# Altium schematic sheet Power_Supplies.SchDoc: =DocumentName
size A4; DocumentNumber: 1; Revision: 0; SheetNumber: 3; SheetTotal: 10; Last modified by: Krzysztof Belewicz
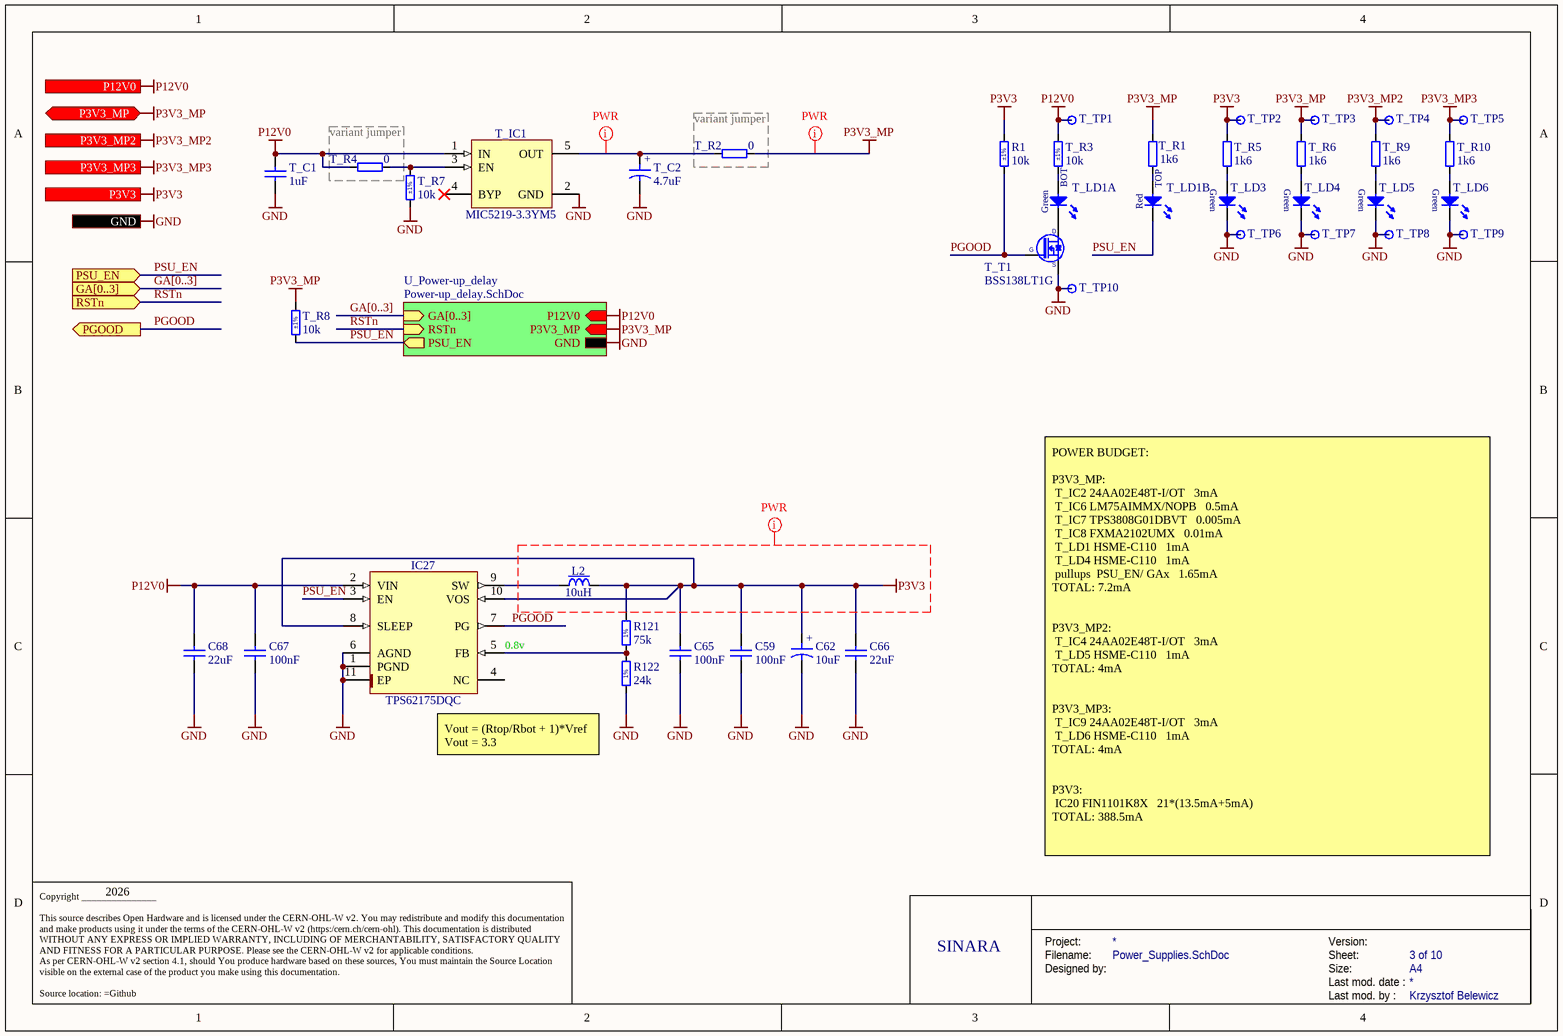
[diagram p0: Power_Supplies.SchDoc]

## Parts
C59  100nF  [CAPC1005X55N]
C62  10uF  [CAPAE430X540N]
C65  100nF  [CAPC1005X55N]
C66  22uF  [CAPC2012X135N]
C67  100nF  [CAPC1005X55N]
C68  22uF  [CAPC2012X135N]
IC27  TPS62175DQC  [SON50P200X300X80-11N-R94X250]
L2  10uH  [IND_MURATA-PS_8400]
R1  10k  Tolerance: ±1%  [RESC1005X40N]
R121  75k  [RESC1005X40N]
R122  24k  [RESC1005X40N]
T_C1  1uF  [CAPC1608X87N]
T_C2  4.7uF  [CAPMP3216X180N]
T_IC1  MIC5219-3.3YM5  [SOT95P280X145-5N]
T_LD1  Red/Green  [LED_DIALIGHT_571-0112F]  (value not drawn)  (parts A,B of 2)
T_LD3  Green  [LED_KINGBRIGHT_KPH-1608CGCK]  (value not drawn)
T_LD4  Green  [LED_KINGBRIGHT_KPH-1608CGCK]  (value not drawn)
T_LD5  Green  [LED_KINGBRIGHT_KPH-1608CGCK]  (value not drawn)
T_LD6  Green  [LED_KINGBRIGHT_KPH-1608CGCK]  (value not drawn)
T_R1  1k6  [RESC1005X40N]
T_R2  0  [RESC1005X40N]
T_R3  10k  Tolerance: ±1%  [RESC1005X40N]
T_R4  0  [RESC1005X40N]
T_R5  1k6  [RESC1005X40N]
T_R6  1k6  [RESC1005X40N]
T_R7  10k  Tolerance: ±1%  [RESC1005X40N]
T_R8  10k  Tolerance: ±1%  [RESC1005X40N]
T_R9  1k6  [RESC1005X40N]
T_R10  1k6  [RESC1005X40N]
T_T1  BSS138LT1G  [SOT95P240X110-3N]
T_TP1  Test Point  [TPS127]  (value not drawn)  (no BOM)
T_TP2  Test Point  [TPS127]  (value not drawn)  (no BOM)
T_TP3  Test Point  [TPS127]  (value not drawn)  (no BOM)
T_TP4  Test Point  [TPS127]  (value not drawn)  (no BOM)
T_TP5  Test Point  [TPS127]  (value not drawn)  (no BOM)
T_TP6  Test Point  [TPS127]  (value not drawn)  (no BOM)
T_TP7  Test Point  [TPS127]  (value not drawn)  (no BOM)
T_TP8  Test Point  [TPS127]  (value not drawn)  (no BOM)
T_TP9  Test Point  [TPS127]  (value not drawn)  (no BOM)
T_TP10  Test Point  [TPS127]  (value not drawn)  (no BOM)

## Blocks framed on the sheet
variant jumper: T_R4
variant jumper: T_R2

## Sub-sheets
U_Power-up_delay = Power-up_delay.SchDoc: GA[0..3] (in), RSTn (in), GND, PSU_EN (out), P3V3_MP (in), P12V0 (in)

## Ports
GA[0..3] (in), GND, P3V3 (out), P3V3_MP2 (in), P3V3_MP3 (in), P3V3_MP (bidir), P12V0 (in), PGOOD (out), PSU_EN (in), RSTn (in)

## Nets
GND: C59.1 C62.2 C65.1 C66.1 C67.1 C68.1 IC27.1(PGND) IC27.6(AGND) IC27.11(EP) R122.1 T_C1.1 T_C2.2 T_IC1.2(GND) T_LD3.1(C) T_LD4.1(C) T_LD5.1(C) T_LD6.1(C) T_R7.1 T_T1.2(S) T_TP6.1 T_TP7.1 T_TP8.1 T_TP9.1 T_TP10.1 ; port GND, sheet U_Power-up_delay/GND
P3V3: C59.2 C62.1 C65.2 C66.2 IC27.8(SLEEP) IC27.10(VOS) L2.2 R1.2 R121.2 T_R5.2 T_TP2.1 ; port P3V3
P3V3_MP: T_R1.2 T_R2.2 T_R6.2 T_R8.2 T_TP3.1 ; port P3V3_MP, sheet U_Power-up_delay/P3V3_MP
P3V3_MP2: T_R9.2 T_TP4.1 ; port P3V3_MP2
P3V3_MP3: T_R10.2 T_TP5.1 ; port P3V3_MP3
P12V0: C67.2 C68.2 IC27.2(VIN) T_C1.2 T_IC1.1(IN) T_R3.2 T_R4.1 T_TP1.1 ; port P12V0, sheet U_Power-up_delay/P12V0
PGOOD: IC27.7(PG) R1.1 T_T1.1(G) ; port PGOOD
PSU_EN: IC27.3(EN) T_LD1.3(C) T_R8.1 ; port PSU_EN, sheet U_Power-up_delay/PSU_EN
RSTn: port RSTn, sheet U_Power-up_delay/RSTn
NetIC27_5: IC27.5(FB) R121.1 R122.2
NetIC27_9: IC27.9(SW) L2.1
NetT_C2_1: T_C2.1 T_IC1.5(OUT) T_R2.1
NetT_IC1_3: T_IC1.3(EN) T_R4.2 T_R7.2
NetT_LD1_1: T_LD1.1(C) T_T1.3(D)
NetT_LD1_2: T_LD1.2(A) T_R3.1
NetT_LD1_4: T_LD1.4(A) T_R1.1
NetT_LD3_2: T_LD3.2(A) T_R5.1
NetT_LD4_2: T_LD4.2(A) T_R6.1
NetT_LD5_2: T_LD5.2(A) T_R9.1
NetT_LD6_2: T_LD6.2(A) T_R10.1

Not connected (* = marked no-connect by the designer): IC27 4(NC); T_IC1 4(BYP)*

## Buses and harness runs
bus GA[0..3] = port GA[0..3]
bus GA[0..3] = sheet U_Power-up_delay/GA[0..3]

## Layout directives
net class PWR: NetT_C2_1, P3V3, P3V3_MP

## Notes on the sheet
- (near IC27) 0.8v
- Vout = (Rtop/Rbot + 1)*Vref
  Vout = 3.3
- POWER BUDGET:
  P3V3_MP:
  T_IC2	24AA02E48T-I/OT			3mA
  T_IC6	LM75AIMMX/NOPB			0.5mA
  T_IC7	TPS3808G01DBVT			0.005mA
  T_IC8	FXMA2102UMX			0.01mA
  T_LD1	HSME-C110			1mA
  T_LD4	HSME-C110			1mA
  pullups 	PSU_EN/ GAx			1.65mA
  TOTAL: 7.2mA
  P3V3_MP2:
  T_IC4	24AA02E48T-I/OT			3mA
  T_LD5	HSME-C110			1mA
  TOTAL: 4mA
  P3V3_MP3:
  T_IC9	24AA02E48T-I/OT			3mA
  T_LD6	HSME-C110			1mA
  TOTAL: 4mA
  P3V3:
  IC20	FIN1101K8X			21*(13.5mA+5mA)
  TOTAL: 388.5mA
- 2026
- SINARA
- Project:
- Designed by:
- Filename:
- Size:
- Version:
- Last mod. date :
- Sheet:
- A4
- Copyright _______________
  This source describes Open Hardware and is licensed under the CERN-OHL-W v2. You may redistribute and modify this documentation and make products using it under the terms of the CERN-OHL-W v2 (https:/cern.ch/cern-ohl). This documentation is distributed WITHOUT ANY EXPRESS OR IMPLIED WARRANTY, INCLUDING OF MERCHANTABILITY, SATISFACTORY QUALITY AND FITNESS FOR A PARTICULAR PURPOSE. Please see the CERN-OHL-W v2 for applicable conditions.
  As per CERN-OHL-W v2 section 4.1, should You produce hardware based on these sources, You must maintain the Source Location visible on the external case of the product you make using this documentation.
  Source location: =Github
- Last mod. by :
- (in symbol CAE430-540_10UF_16V_20%) +
- (in symbol CTE3216-18_4.7UF_10V_10%_AVX_TPSA475K010T1400) +
- (in symbol LED_DIALIGHT_571-0112F, part A) BOT; Green
- (in symbol LED_DIALIGHT_571-0112F, part B) TOP; Red
- (in symbol R0402_24K_1%_0.0625W_100PPM) 1%
- (in symbol R0402_75K_1%_0.0625W_100PPM) 1%

## Library data of the parts
C59 C65 C67 = CC0402_100NF_50V_10%_X7R: Non-polarised capacitor; Part Description: SMD Multilayer Chip Ceramic Capacitor; Manufacturer: GENERIC; Manufacturer1 Part Number: GRM155R71H104KE14D; Voltage: 50V; TC: X7R; Tolerance: ±10%; Part Number: CC0402_100NF_50V_10%_X7R; Component Kind: Standard; Component Type: Standard; Pin Count: 2; Value: 100nF; Status: None; Manufacturer Part Number: CC0402_100NF_50V_10%_X7R; Case: 0402; Mounted: Yes; Socket: No; SMD: Yes; Sense: No; HelpURL: \\cern.ch\dfs\Applications\Altium\Datasheets\CC0402_MURATA_GRM155R71H104KE14D.pdf; Author: CERN DEM MR; CreateDate: 30.06.2017; LatestRevisionDate: 30.06.2017; Manufacturer1 Example: MURATA; Manufacturer1 ComponentHeight: 0.55mm
C62 = CAE430-540_10UF_16V_20%: Polarised capacitor; Part Description: Aluminum Electrolytic SMT Capacitor; Manufacturer: PANASONIC; Manufacturer Part Number: EEEFK1C100AR; Voltage: 16V; Tolerance: ±20%; Part Number: CAE430-540_10UF_16V_20%; Component Kind: Standard; Component Type: Standard; Pin Count: 2; Value: 10uF; Status: Not Recommended; Case: B; Mounted: Yes; Socket: No; SMD: Yes; Sense: No; ComponentHeight: 5.8mm; HelpURL: \\cern.ch\dfs\Applications\Altium\Datasheets\CAE_PANASONIC_FK.pdf; Author: CERN DEM JLC; CreateDate: 03.12.2007; LatestRevisionDate: 05.11.2014
C66 C68 = CC0805_22UF_16V_10%_X5R: Non-polarised capacitor; Part Description: SMD Multilayer Chip Ceramic Capacitor; Manufacturer: GENERIC; Manufacturer1 Part Number: C2012X5R1C226KT; Voltage: 16V; TC: X5R; Tolerance: ±10%; Part Number: CC0805_22UF_16V_10%_X5R; Component Kind: Standard; Component Type: Standard; Pin Count: 2; Value: 22uF; Status: Preferred; Manufacturer Part Number: CC0805_22UF_16V_10%_X5R; Case: 0805; Mounted: Yes; Socket: No; SMD: Yes; Sense: No; Manufacturer1 Example: TDK; Manufacturer1 ComponentHeight: 1.35mm; HelpURL: \\cern.ch\dfs\Applications\Altium\Datasheets\CC0805_X5R_TDK_C.pdf; Author: CERN DEM JLC; CreateDate: 25.10.2012; LatestRevisionDate: 25.10.2012
IC27 = TPS62175DQC: 4.75-28VDC to 1-6VDC, 500mA Step-Down Converter With Sleep Mode; Manufacturer: TEXAS INSTRUMENTS; PressFit: No; Bonding: No; Part Number: TPS62175DQC; Component Kind: Standard; Component Type: Standard; Device: TPS62175DQC; PackageDescription: SON, 10-Leads, Body 2x3mm, Pitch 0.5mm, Thermal Pad 0.94x2.5mm, IPC Medium Density; Part Description: 4.75-28VDC to 1-6VDC, 500mA Step-Down Converter With Sleep Mode; Manufacturer Part Number: TPS62175DQC; Pin Count: 11; Case: SON10; Mounted: Yes; Socket: No; SMD: Yes; Sense: No; ComponentHeight: 0.8mm; HelpURL: \\cern.ch\dfs\Applications\Altium\Datasheets\TPS62175DQC.pdf; Author: CERN DEM JMW; CreateDate: 11.08.2015; LatestRevisionDate: 11.08.2015
L2 = IND_10UH_10%_MURATA-PS_8400: Inductor With Core; Part Description: Miniature Surface Mount Power Inductor (8400 Serie); Manufacturer: MURATA POWER SOLUTIONS; Manufacturer Part Number: 84103C; Power: 950mA; Resistance: 0.24R; Tolerance: ±10%; Part Number: IND_10UH_10%_MURATA-PS_8400; Component Kind: Standard; Component Type: Standard; Pin Count: 2; Value: 10uH; Status: None; Mounted: Yes; Socket: No; SMD: Yes; Sense: No; ComponentHeight: 2.9mm; HelpURL: \\cern.ch\dfs\Applications\Altium\Datasheets\IND_MURATA-PS_8400.pdf; Author: CERN DEM JLC; CreateDate: 02.07.2012; LatestRevisionDate: 02.07.2012
R1 T_R3 T_R7 T_R8 = R0402_10K_1%_0.0625W_100PPM: Resistor - 1%; Part Description: General Purpose Thick Film Chip Resistor; Manufacturer: GENERIC; Manufacturer1 Part Number: 232270671003L; TC: ±100ppm/°C; PressFit: No; Part Number: R0402_10K_1%_0.0625W_100PPM; Component Kind: Standard; Component Type: Standard; Pin Count: 2; Value: 10k; Status: Not Recommended; Power: 0.0625W; Manufacturer Part Number: R0402_10K_1%_0.0625W_100PPM; Case: 0402; Mounted: Yes; Sense: No; Socket: No; SMD: Yes; Manufacturer1 Example: YAGEO PHYCOMP; Manufacturer1 ComponentHeight: 0.4mm; HelpURL: \\cern.ch\dfs\Applications\Altium\Datasheets\R0402_Phycomp_RC0402.pdf; Author: CERN DEM JLC; CreateDate: 03.12.2007; LatestRevisionDate: 17.10.2012
R121 = R0402_75K_1%_0.0625W_100PPM: Resistor - 1%; Part Description: General Purpose Thick Film Chip Resistor; Manufacturer: GENERIC; Manufacturer1 Part Number: 232270677503L; TC: ±100ppm/°C; PressFit: No; Part Number: R0402_75K_1%_0.0625W_100PPM; Component Kind: Standard; Component Type: Standard; Pin Count: 2; Value: 75k; Status: Not Recommended; Power: 0.0625W; Tolerance: ±1%; Manufacturer Part Number: R0402_75K_1%_0.0625W_100PPM; Case: 0402; Mounted: Yes; Sense: No; Socket: No; SMD: Yes; Manufacturer1 Example: YAGEO PHYCOMP; Manufacturer1 ComponentHeight: 0.4mm; HelpURL: \\cern.ch\dfs\Applications\Altium\Datasheets\R0402_Phycomp_RC0402.pdf; Author: CERN DEM JLC; CreateDate: 03/12/2007; LatestRevisionDate: 17/10/2012
R122 = R0402_24K_1%_0.0625W_100PPM: Resistor - 1%; Part Description: General Purpose Thick Film Chip Resistor; Manufacturer: GENERIC; Manufacturer1 Part Number: 232270672403L; TC: ±100ppm/°C; PressFit: No; Part Number: R0402_24K_1%_0.0625W_100PPM; Component Kind: Standard; Component Type: Standard; Pin Count: 2; Value: 24k; Status: Not Recommended; Power: 0.0625W; Tolerance: ±1%; Manufacturer Part Number: R0402_24K_1%_0.0625W_100PPM; Case: 0402; Mounted: Yes; Sense: No; Socket: No; SMD: Yes; Manufacturer1 Example: YAGEO PHYCOMP; Manufacturer1 ComponentHeight: 0.4mm; HelpURL: \\cern.ch\dfs\Applications\Altium\Datasheets\R0402_Phycomp_RC0402.pdf; Author: CERN DEM JLC; CreateDate: 03/12/2007; LatestRevisionDate: 17/10/2012
T_C1 = CC0603_1UF_25V_10%_X7R: Non-polarised capacitor; Part Description: SMD Multilayer Chip Ceramic Capacitor; Manufacturer: GENERIC; Manufacturer1 Part Number: GRM188R71E105KA12D; Voltage: 25V; TC: X7R; Tolerance: ±10%; Part Number: CC0603_1UF_25V_10%_X7R; Component Kind: Standard; Component Type: Standard; Pin Count: 2; Value: 1uF; Status: None; Manufacturer Part Number: CC0603_1UF_25V_10%_X7R; Case: 0603; Mounted: Yes; Socket: No; SMD: Yes; Sense: No; Manufacturer1 Example: MURATA; Manufacturer1 ComponentHeight: 0.9mm; HelpURL: \\cern.ch\dfs\Applications\Altium\Datasheets\CC0603_X7R_MURATA.pdf; Author: CERN DEM JLC; CreateDate: 18.01.2011; LatestRevisionDate: 18.01.2011
T_C2 = CTE3216-18_4.7UF_10V_10%_AVX_TPSA475K010T1400: Polarised capacitor; Part Description: Low ESR 1R4 Automotive Solid Tantalum Chip Capacitor; Manufacturer: AVX; Voltage: 10V; Tolerance: ±10%; Part Number: CTE3216-18_4.7UF_10V_10%_AVX_TPSA475K010T1400; Component Kind: Standard; Component Type: Standard; Pin Count: 2; Value: 4.7uF; Status: Preferred; Manufacturer Part Number: TPSA475K010T1400; Case: A; Mounted: Yes; Socket: No; SMD: Yes; Sense: No; ComponentHeight: 1.8mm; HelpURL: \\cern.ch\dfs\Applications\Altium\Datasheets\CTE-LESR_AVX_TPS-AUTO.pdf; Author: CERN DEM JLC; CreateDate: 23.01.2018; LatestRevisionDate: 23.01.2018
T_IC1 = MIC5219-3.3YM5: 500mA Peak Output LDO Regulator; Part Description: 3.3V 500mA Peak Output Low Drop-Out  (LDO) Regulator; Manufacturer: MICROCHIP TECHNOLOGY; PressFit: No; Bonding: No; Part Number: MIC5219-3.3YM5; Component Kind: Standard; Component Type: Standard; Device: MIC5219-3.3YM5; PackageDescription: SOT, 0.95mm pitch; 5 pin, 1.60mm W X 2.90mm L X 1.45mm H body, IPC Medium Density; Manufacturer Part Number: MIC5219-3.3YM5; Pin Count: 5; Case: SOT23-5; Mounted: Yes; Socket: No; SMD: Yes; Sense: No; ComponentHeight: 1.45mm; HelpURL: \\cern.ch\dfs\Applications\Altium\Datasheets\MIC5219-3.3YM5.pdf; Author: CERN DEM WB; CreateDate: 2019-04-16; LatestRevisionDate: 2019-04-16
T_LD1 = LED_DIALIGHT_571-0112F: 2x LED  Botom Green, Top Red; Part Description: Dual 2mm  LEDs, Red Top,Green Bot, CBI® Circuit Board Indicator (Without positioning pins); PressFit: No; Bonding: No; Part Number: LED_DIALIGHT_571-0112F; Component Kind: Standard; Component Type: Standard; Color: Red/Green; PackageDescription: 2x 2mm LED (Top: Red, Bot: Green) PCB Edge Mounting (Without positioning pins) DIALIGHT 571 Serie; Manufacturer: DIALIGHT; Manufacturer Part Number: 571-0112F; Pin Count: 4; Mounted: Yes; Socket: No; SMD: No; Sense: No; ComponentHeight: 8.6mm; HelpURL: \\cern.ch\dfs\Applications\Altium\Datasheets\LED_DIALIGHT_571-0112F.pdf; Author: CERN DEM JLC; CreateDate: 09.11.2009; LatestRevisionDate: 17.03.2010
T_LD3-T_LD6 = LED_KINGBRIGHT_KPH-1608CGCK: LED Green 1C 2A; Part Description: SMD Green LED, Case 1.6mmX0.8mm(0603), 0.65mm Thickness; PressFit: No; Bonding: No; Part Number: LED_KINGBRIGHT_KPH-1608CGCK; Component Kind: Standard; Component Type: Standard; Color: Green; PackageDescription: SMT Green LED, Case 0603, Body L 1.6 x W 0.8mm H 0.65mm; Manufacturer: KINGBRIGHT; Manufacturer Part Number: KPH-1608CGCK; Pin Count: 2; Mounted: Yes; Socket: No; SMD: Yes; Sense: No; ComponentHeight: 0.65mm; HelpURL: \\cern.ch\dfs\Applications\Altium\Datasheets\LED_KINGBRIGHT_KPH-1608CGCK.pdf; Author: CERN DEM JLC; CreateDate: 03.07.2017; LatestRevisionDate: 03.07.2017
T_R1 T_R5 T_R6 T_R9 T_R10 = R0402_1K6_1%_0.0625W_100PPM: Resistor - 1%; Part Description: General Purpose Thick Film Chip Resistor; Manufacturer: GENERIC; Manufacturer1 Part Number: 232270671602L; TC: ±100ppm/°C; PressFit: No; Part Number: R0402_1K6_1%_0.0625W_100PPM; Component Kind: Standard; Component Type: Standard; Pin Count: 2; Value: 1k6; Status: Not Recommended; Power: 0.0625W; Tolerance: ±1%; Manufacturer Part Number: R0402_1K6_1%_0.0625W_100PPM; Case: 0402; Mounted: Yes; Sense: No; Socket: No; SMD: Yes; Manufacturer1 Example: YAGEO PHYCOMP; Manufacturer1 ComponentHeight: 0.4mm; HelpURL: \\cern.ch\dfs\Applications\Altium\Datasheets\R0402_Phycomp_RC0402.pdf; Author: CERN DEM JLC; CreateDate: 03.12.2007; LatestRevisionDate: 17.10.2012
T_R2 T_R4 = R0402_0R_JUMPER: Resistor; Part Description: 1A (0.05R Max DC Resistance) Zero Ohm Jumper; Manufacturer: GENERIC; Manufacturer1 Part Number: 232270591001L; PressFit: No; Part Number: R0402_0R_JUMPER; Component Kind: Standard; Component Type: Standard; Pin Count: 2; Value: 0; Status: Not Recommended; Manufacturer Part Number: R0402_0R_JUMPER; Case: 0402; Mounted: Yes; Sense: No; Socket: No; SMD: Yes; Manufacturer1 Example: YAGEO PHYCOMP; Manufacturer1 ComponentHeight: 0.4mm; HelpURL: \\cern.ch\dfs\Applications\Altium\Datasheets\R0402_Phycomp_RC0402.pdf; Author: CERN DEM JLC; CreateDate: 03.12.2007; LatestRevisionDate: 17.10.2012
T_T1 = BSS138LT1G: N-CHANNEL MOSFET WITH DIODE; Part Description: 50V, 200mA N-Channel Enhancement Mode Field-Effect Transistor; Manufacturer: ON SEMICONDUCTOR; PressFit: No; Bonding: No; Part Number: BSS138LT1G; Component Kind: Standard; Component Type: Standard; Device: BSS138LT1G; PackageDescription: SOT23, 0.95mm Pitch; 3 Pin, 1.40mm W X 3.00mm L X 1.10mm H body, IPC Medium Density; Manufacturer Part Number: BSS138L; Pin Count: 3; Case: SOT23-3; Mounted: Yes; Socket: No; SMD: Yes; Sense: No; ComponentHeight: 1.11mm; HelpURL: \\cern.ch\dfs\Applications\Altium\Datasheets\BSS138LT1G.pdf; Author: CERN DEM JLC; CreateDate: 23.03.2009; LatestRevisionDate: 25.05.2022
T_TP1-T_TP10 = SMD_PAD_1.27X1.27MM: Part Description: 1.27mm x 1.27mm PCB Copper Area (SMD Test Point); Mounted: No; Part Number: SMD_PAD_1.27X1.27MM; Component Type: Standard (No BOM); Pin Count: 1; Family: Test Point; Socket: No; SMD: Yes; Sense: No; Status: None; ComponentHeight: 0mm; HelpURL: Undefined; Author: CERN DEM JLC; CreateDate: 12.01.2008; LatestRevisionDate: 12.01.2008; PackageDescription: 1.27mm x 1.27mm PCB Copper Area (SMD Test Point)